# EAGLE design motor_back (EAGLE 7.7.0)
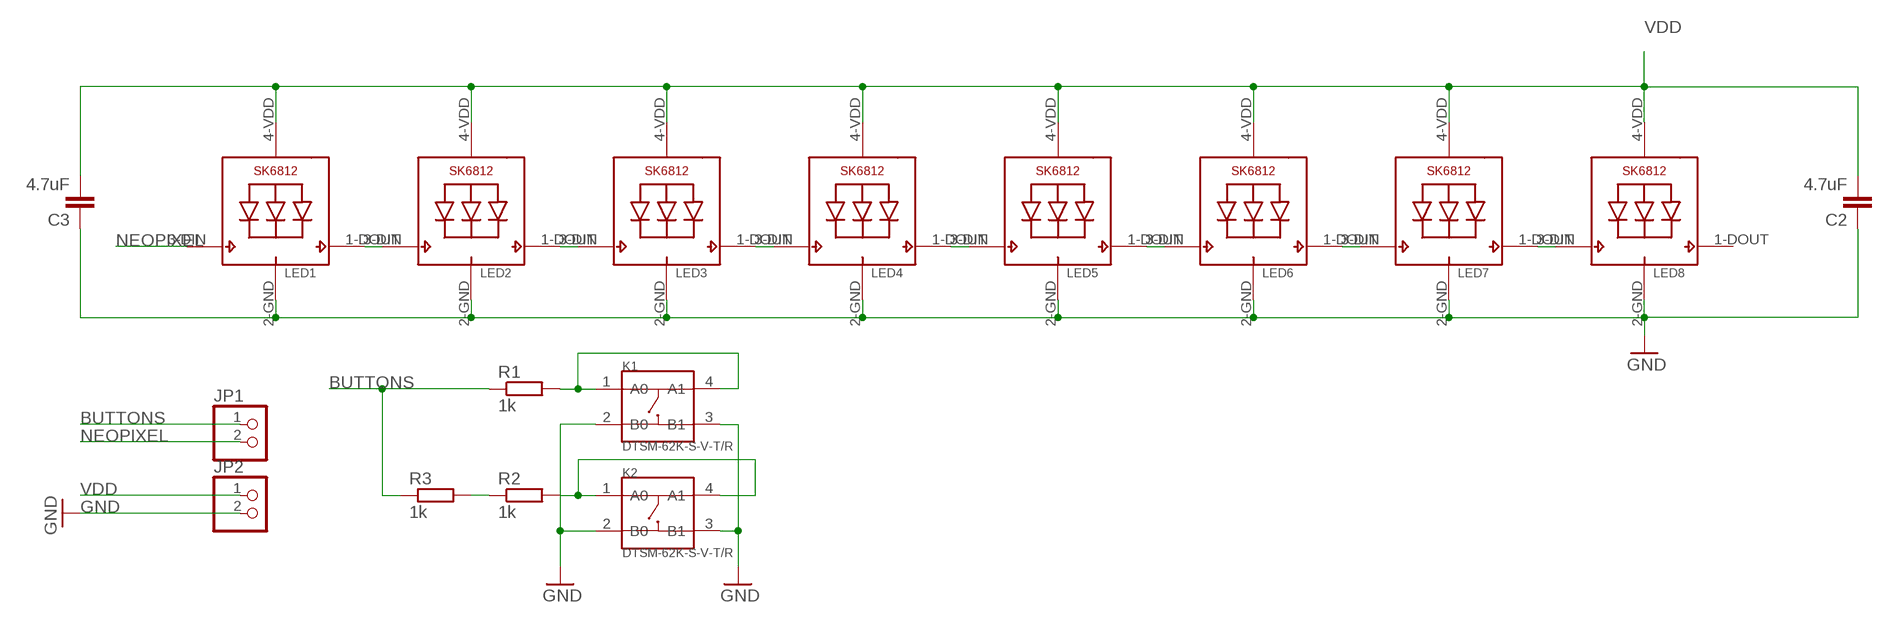
[diagram p0: schematic, sheet 1]

## Parts
C2  4.7uF  C-EUC0805  [C0805]
C3  4.7uF  C-EUC0805  [C0805]
JP1  PINHD-1X2  [1X02]
JP2  PINHD-1X2  [1X02]
K1  DTSM-62K-S-V-T/R  SMD-SWITCH-TACTILE-SPST-NO(4P-D6.0MM)  [SW4-SMD-6.0X6.0X5.0MM]
K2  DTSM-62K-S-V-T/R  SMD-SWITCH-TACTILE-SPST-NO(4P-D6.0MM)  [SW4-SMD-6.0X6.0X5.0MM]
LED1  SK6812_3535  [LED3535]
LED2  SK6812_3535  [LED3535]
LED3  SK6812_3535  [LED3535]
LED4  SK6812_3535  [LED3535]
LED5  SK6812_3535  [LED3535]
LED6  SK6812_3535  [LED3535]
LED7  SK6812_3535  [LED3535]
LED8  SK6812_3535  [LED3535]
R1  1k  R-EU_R0603  [R0603]
R2  1k  R-EU_R0603  [R0603]
R3  1k  R-EU_R0603  [R0603]

## Nets
BUTTONS: JP1.1 R1.1 R3.1
GND: C2.1 C3.1 JP2.2 K1.2(B0) K1.3(B1) K2.2(B0) K2.3(B1) LED1.2-GND(GND) LED2.2-GND(GND) LED3.2-GND(GND) LED4.2-GND(GND) LED5.2-GND(GND) LED6.2-GND(GND) LED7.2-GND(GND) LED8.2-GND(GND)
N$1: LED1.1-DOUT(DO) LED2.3-DIN(DI)
N$2: LED2.1-DOUT(DO) LED3.3-DIN(DI)
N$3: LED3.1-DOUT(DO) LED4.3-DIN(DI)
N$4: LED4.1-DOUT(DO) LED5.3-DIN(DI)
N$5: LED5.1-DOUT(DO) LED6.3-DIN(DI)
N$6: LED6.1-DOUT(DO) LED7.3-DIN(DI)
N$7: LED7.1-DOUT(DO) LED8.3-DIN(DI)
N$13: K1.1(A0) K1.4(A1) R1.2
N$14: K2.1(A0) K2.4(A1) R2.2
N$15: R2.1 R3.2
NEOPIXEL: JP1.2 LED1.3-DIN(DI)
VDD: C2.2 C3.2 JP2.1 LED1.4-VDD(VDD) LED2.4-VDD(VDD) LED3.4-VDD(VDD) LED4.4-VDD(VDD) LED5.4-VDD(VDD) LED6.4-VDD(VDD) LED7.4-VDD(VDD) LED8.4-VDD(VDD)
Unconnected: LED8.1-DOUT(DO)

## Library data of the parts
C2 C3 = rcl:C-EU: CAPACITOR, European symbol
JP1 JP2 = pinhead:PINHD-1X2: PIN HEADER
K1 K2 = Seeed-OPL-Button:SMD-SWITCH-TACTILE-SPST-NO(4P-D6.0MM): 311020004; MPN: DTSM-62K-S-V-T/R
LED1-LED8 = SK6812:SK6812
R1-R3 = rcl:R-EU_: RESISTOR, European symbol

## Board
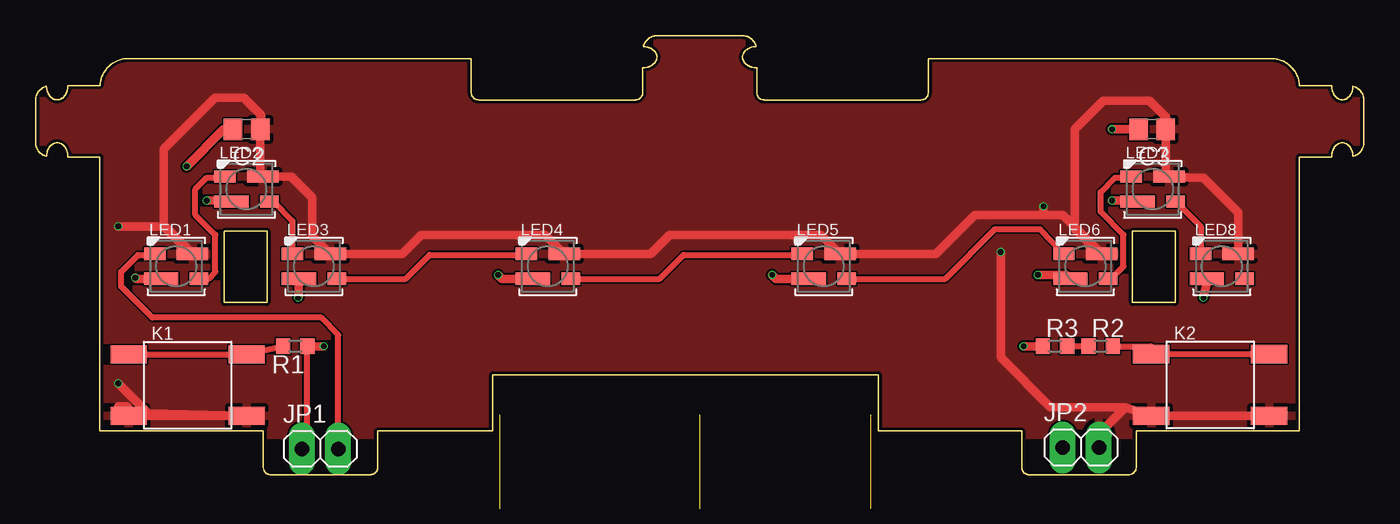
[diagram p1: board, top side]
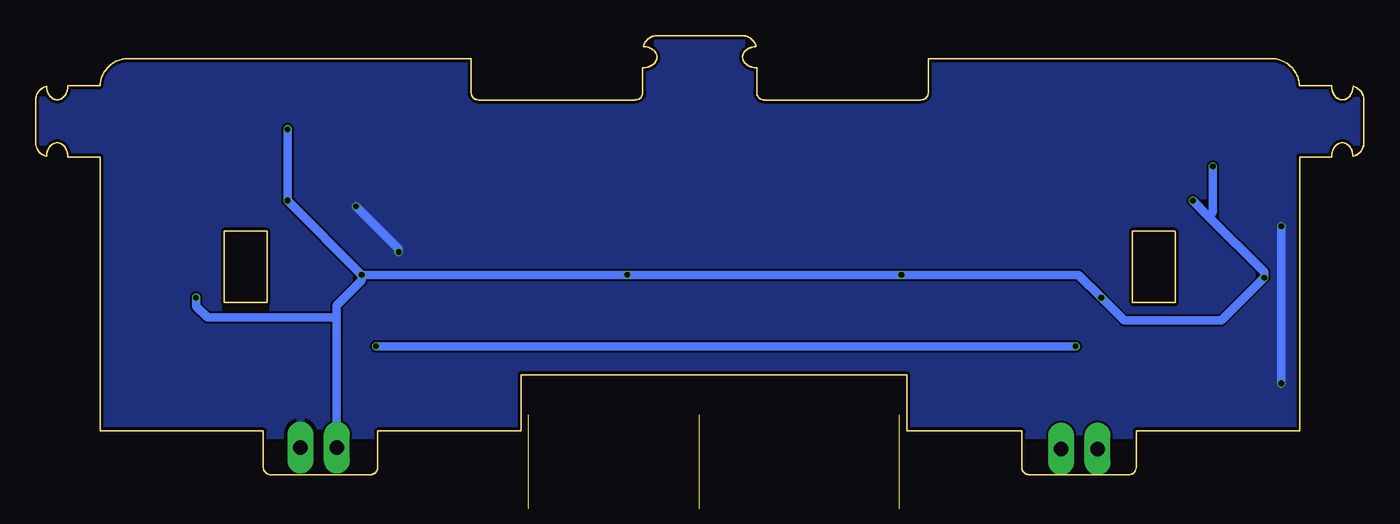
[diagram p2: board, bottom side, seen from below]

Size 93 x 30.76 mm. Coordinates in mm from the lower left corner, seen from the top.
Outline: 43.5,30.76 43.45,30.75 43.39,30.75 43.34,30.74 43.29,30.73 43.24,30.72 43.19,30.7 43.14,30.69 43.09,30.67 43.04,30.64 43,30.61 42.95,30.59 42.91,30.55 42.87,30.52 42.83,30.49 42.79,30.45 42.76,30.41 42.72,30.37 42.69,30.32 42.67,30.28 42.64,30.23 42.62,30.19 42.59,30.14 42.58,30.09 42.56,30.04 42.56,30 42.67,29.99 42.72,29.98 42.82,29.96 42.87,29.95 42.92,29.93 42.97,29.91 43.02,29.89 43.07,29.87 43.12,29.84 43.16,29.82 43.21,29.78 43.25,29.75 43.29,29.72 43.32,29.68 43.36,29.64 43.39,29.6 43.42,29.55 43.44,29.5 43.46,29.46 43.48,29.41 43.49,29.36 43.5,29.3 43.5,29.25 43.5,29.2 43.49,29.14 43.48,29.09 43.46,29.04 43.44,28.99 43.41,28.95 43.38,28.9 43.35,28.86 43.32,28.82 43.28,28.79 43.24,28.75 43.2,28.72 43.15,28.69 43.11,28.66 43.06,28.64 43.01,28.61 42.97,28.59 42.92,28.57 42.87,28.56 42.81,28.54 42.71,28.52 42.61,28.51 42.5,28.51 42.5,26.76 42.5,26.71 42.49,26.66 42.48,26.6 42.46,26.55 42.43,26.51 42.4,26.46 42.37,26.42 42.33,26.38 42.29,26.35 42.25,26.32 42.2,26.3 42.15,26.28 42.1,26.27 42.05,26.26 42,26.26 31.04,26.26 30.99,26.26 30.94,26.26 30.88,26.27 30.83,26.28 30.79,26.3 30.74,26.33 30.7,26.36 30.65,26.39 30.62,26.43 30.59,26.47 30.56,26.52 30.54,26.57 30.52,26.62 30.51,26.67 30.5,26.72 30.5,26.77 30.5,29.16 6.53,29.16 6.43,29.16 6.37,29.15 6.27,29.14 6.16,29.13 6.06,29.11 6.01,29.1 5.96,29.08 5.85,29.05 5.76,29.01 5.66,28.97 5.61,28.95 5.52,28.9 5.47,28.87 5.38,28.82 5.3,28.75 5.25,28.72 5.17,28.65 5.1,28.58 5.02,28.5 4.99,28.47 4.92,28.38 4.86,28.3 4.8,28.21 4.77,28.16 4.72,28.07 4.68,27.98 4.64,27.88 4.6,27.78 4.57,27.68 4.56,27.63 4.54,27.52 4.53,27.47 4.51,27.36 4.51,27.26 4.46,27.26 2.29,27.26 2.25,27.24 2.24,27.13 2.23,27.03 2.21,26.93 2.19,26.88 2.18,26.82 2.16,26.77 2.14,26.73 2.11,26.68 2.09,26.63 2.06,26.59 2.03,26.55 2,26.5 1.96,26.46 1.92,26.43 1.88,26.39 1.84,26.36 1.79,26.34 1.75,26.31 1.7,26.29 1.65,26.27 1.6,26.26 1.54,26.26 1.49,26.26 1.44,26.26 1.38,26.27 1.33,26.28 1.28,26.3 1.24,26.32 1.19,26.35 1.15,26.38 1.1,26.41 1.06,26.44 1.03,26.48 0.99,26.52 0.96,26.56 0.93,26.61 0.91,26.65 0.88,26.7 0.86,26.75 0.84,26.8 0.82,26.85 0.81,26.9 0.78,27 0.77,27.05 0.75,27.21 0.7,27.19 0.65,27.18 0.6,27.16 0.55,27.13 0.51,27.11 0.46,27.08 0.42,27.05 0.38,27.02 0.33,26.99 0.3,26.95 0.26,26.91 0.22,26.87 0.19,26.83 0.16,26.79 0.13,26.75 0.11,26.7 0.08,26.65 0.06,26.6 0.05,26.55 0.03,26.5 0.02,26.45 0.01,26.4 0,26.34 0,26.29 0,23.28 0,23.22 0,23.17 0.01,23.12 0.02,23.07 0.03,23.01 0.04,22.96 0.06,22.91 0.08,22.86 0.1,22.82 0.13,22.77 0.16,22.73 0.19,22.68 0.22,22.64 0.26,22.6 0.29,22.56 0.33,22.53 0.37,22.49 0.42,22.46 0.46,22.43 0.51,22.41 0.55,22.38 0.6,22.36 0.65,22.34 0.7,22.32 0.75,22.31 0.76,22.35 0.77,22.46 0.79,22.56 0.8,22.61 0.82,22.66 0.84,22.71 0.86,22.76 0.88,22.81 0.9,22.86 0.93,22.9 0.96,22.95 0.99,22.99 1.03,23.03 1.06,23.07 1.1,23.1 1.14,23.14 1.19,23.16 1.23,23.19 1.28,23.21 1.33,23.23 1.38,23.24 1.43,23.25 1.49,23.26 1.54,23.25 1.59,23.25 1.64,23.24 1.69,23.22 1.74,23.2 1.79,23.18 1.84,23.15 1.88,23.12 1.92,23.09 1.96,23.05 1.99,23.01 2.03,22.97 2.06,22.93 2.09,22.88 2.11,22.84 2.14,22.79 2.16,22.74 2.18,22.69 2.19,22.64 2.21,22.59 2.23,22.49 2.24,22.38 2.25,22.28 2.28,22.26 4.45,22.26 4.5,22.25 4.5,3.1 4.51,3.06 15.94,3.06 15.94,3 15.94,0.52 15.94,0.47 15.95,0.41 15.96,0.36 15.98,0.31 16,0.26 16.03,0.22 16.06,0.18 16.1,0.14 16.14,0.1 16.18,0.07 16.23,0.05 16.28,0.03 16.33,0.01 16.38,0 16.43,0 16.49,0 23.42,0 23.47,0 23.52,0.01 23.58,0.02 23.63,0.04 23.67,0.06 23.72,0.08 23.76,0.12 23.8,0.15 23.84,0.19 23.87,0.23 23.89,0.28 23.91,0.33 23.93,0.38 23.94,0.43 23.94,0.48 23.94,0.54 23.94,3.02 23.96,3.06 32,3.06 32,7 59,7 59,3.06 69.04,3.06 69.06,3.02 69.06,0.53 69.06,0.48 69.06,0.42 69.07,0.37 69.09,0.32 69.11,0.27 69.14,0.23 69.17,0.18 69.21,0.15 69.24,0.11 69.29,0.08 69.33,0.05 69.38,0.03 69.43,0.02 69.48,0.01 69.54,0 69.59,0 76.52,0 76.57,0 76.63,0.01 76.68,0.01 76.73,0.03 76.78,0.05 76.82,0.08 76.87,0.11 76.91,0.14 76.94,0.18 76.97,0.23 77,0.27 77.02,0.32 77.04,0.37 77.05,0.42 77.06,0.47 77.06,0.53 77.06,3.01 77.07,3.06 88.49,3.06 88.5,3.1 88.5,22.21 88.5,22.26 90.72,22.26 90.75,22.28 90.76,22.39 90.77,22.49 90.78,22.55 90.79,22.6 90.81,22.65 90.83,22.7 90.85,22.75 90.87,22.8 90.89,22.84 90.92,22.89 90.95,22.93 90.98,22.98 91.01,23.02 91.05,23.06 91.09,23.09 91.13,23.12 91.17,23.16 91.22,23.18 91.26,23.21 91.31,23.23 91.36,23.24 91.42,23.25 91.47,23.26 91.52,23.26 91.57,23.25 91.63,23.24 91.68,23.23 91.73,23.21 91.77,23.19 91.82,23.16 91.86,23.13 91.9,23.1 91.94,23.06 91.98,23.02 92.01,22.98 92.04,22.94 92.07,22.89 92.1,22.85 92.12,22.8 92.15,22.75 92.17,22.7 92.18,22.66 92.2,22.6 92.21,22.55 92.23,22.45 92.24,22.34 92.26,22.31 92.31,22.32 92.36,22.34 92.41,22.36 92.45,22.39 92.5,22.41 92.55,22.44 92.59,22.47 92.63,22.5 92.67,22.53 92.71,22.57 92.75,22.61 92.78,22.65 92.82,22.69 92.85,22.73 92.87,22.78 92.9,22.82 92.92,22.87 92.94,22.92 92.96,22.97 92.97,23.02 92.98,23.07 92.99,23.13 93,23.18 93,23.23 93,23.28 93,26.3 93,26.35 92.99,26.41 92.98,26.46 92.97,26.51 92.95,26.56 92.93,26.61 92.91,26.66 92.89,26.71 92.86,26.75 92.84,26.8 92.8,26.84 92.77,26.88 92.74,26.92 92.7,26.96 92.66,26.99 92.62,27.03 92.57,27.06 92.53,27.09 92.48,27.11 92.44,27.14 92.39,27.16 92.34,27.18 92.29,27.19 92.24,27.2 92.23,27.1 92.22,26.99 92.19,26.89 92.18,26.84 92.16,26.79 92.14,26.74 92.12,26.69 92.09,26.65 92.06,26.6 92.03,26.56 92,26.52 91.97,26.48 91.93,26.44 91.89,26.4 91.85,26.37 91.8,26.34 91.76,26.32 91.71,26.3 91.66,26.28 91.61,26.27 91.55,26.26 91.5,26.26 91.45,26.26 91.4,26.27 91.34,26.28 91.29,26.29 91.25,26.32 91.2,26.34 91.15,26.37 91.11,26.4 91.07,26.43 91.03,26.47 91,26.51 90.97,26.55 90.94,26.59 90.91,26.64 90.88,26.69 90.86,26.73 90.84,26.78 90.82,26.83 90.8,26.88 90.79,26.93 90.77,27.04 90.75,27.14 90.75,27.25 90.71,27.26 88.54,27.26 88.49,27.27 88.49,27.37 88.47,27.48 88.46,27.53 88.44,27.63 88.41,27.74 88.4,27.79 88.36,27.89 88.32,27.98 88.27,28.08 88.25,28.13 88.2,28.22 88.14,28.3 88.07,28.39 88.01,28.47 87.97,28.51 87.9,28.59 87.82,28.66 87.74,28.73 87.65,28.79 87.61,28.82 87.52,28.88 87.43,28.93 87.38,28.95 87.29,29 87.24,29.02 87.14,29.05 87.04,29.08 86.99,29.1 86.88,29.12 86.78,29.14 86.72,29.14 86.62,29.15 86.57,29.16 86.46,29.16 62.54,29.16 62.5,29.15 62.5,26.77 62.5,26.71 62.49,26.66 62.48,26.61 62.46,26.56 62.44,26.51 62.41,26.47 62.38,26.43 62.34,26.39 62.3,26.36 62.25,26.32 62.21,26.3 62.16,26.28 62.11,26.27 62.05,26.26 62,26.26 51.05,26.26 51,26.26 50.94,26.26 50.89,26.27 50.84,26.28 50.79,26.3 50.74,26.33 50.7,26.36 50.66,26.39 50.62,26.43 50.59,26.47 50.56,26.51 50.54,26.56 50.52,26.61 50.51,26.66 50.5,26.71 50.5,26.77 50.5,28.46 50.49,28.51 50.39,28.51 50.28,28.52 50.18,28.55 50.13,28.56 50.08,28.58 50.03,28.59 49.98,28.61 49.93,28.64 49.88,28.66 49.84,28.69 49.8,28.72 49.75,28.75 49.71,28.79 49.68,28.83 49.64,28.87 49.61,28.91 49.58,28.95 49.56,29 49.54,29.05 49.52,29.1 49.51,29.15 49.5,29.2 49.5,29.26 49.5,29.31 49.51,29.36 49.52,29.41 49.54,29.46 49.56,29.51 49.59,29.56 49.61,29.6 49.65,29.64 49.68,29.68 49.72,29.72 49.76,29.76 49.8,29.79 49.84,29.82 49.89,29.85 49.94,29.87 49.98,29.89 50.03,29.91 50.08,29.93 50.13,29.95 50.24,29.97 50.34,29.99 50.45,30 50.44,30.05 50.42,30.1 50.4,30.14 50.38,30.19 50.36,30.24 50.33,30.29 50.3,30.33 50.27,30.37 50.24,30.41 50.2,30.45 50.16,30.49 50.12,30.53 50.08,30.56 50.04,30.59 50,30.62 49.95,30.65 49.9,30.67 49.85,30.69 49.8,30.71 49.75,30.72 49.7,30.73 49.65,30.75 49.6,30.75 49.54,30.75 43.51,30.76
Outline: 13.24,17.06 16.15,17.06 16.2,17.05 16.2,12.08 16.17,12.06 13.21,12.06 13.2,12.1 13.2,17.02
Outline: 76.82,17.06 79.78,17.06 79.8,17.02 79.8,12.1 79.79,12.06 76.83,12.06 76.8,12.08 76.8,17.06
Copper layers (1*16): Top 0.035mm / dielectric 1.6mm / Bottom 0.035mm
Design rules "jlcpcb-2layers *": minimum track width 5mil, minimum drill 0.3mm, track to track 5mil, track to pad 5mil, pad to pad 5mil, via to via 5mil, smd to smd 5mil, copper to edge 0.2mm, drill to drill 6mil, minimum pad ring 10mil, minimum via ring 3mil, stop-mask expansion 4mil, vias tented up to drill 25mil, thermal gap 10mil

### Footprints (pad centres in the part's own frame; a part is rotated, then mirrored left to right if it is on the bottom)
C0805 = smd 1.3 x 1.5: 1 -0.95,0; 2 0.95,0
1X02 = drill 1.016 long: 1 -1.27,0; 2 1.27,0
SW4-SMD-6.0X6.0X5.0MM = smd 2.54 x 1.27: 1 -4.129,2.159; 2 -4.129,-2.159; 3 4.129,-2.159; 4 4.129,2.159
LED3535 = smd 1.3 x 0.85: 1-DOUT 1.6,-0.875 | smd 2.2 x 0.85: 2-GND 1.15,0.875 | smd 1.5 x 0.85: 3-DIN -1.5,0.875 | smd 2.4 x 0.85: 4-VDD -1.05,-0.875
R0603 = smd 1 x 1.1: 1 -0.85,0; 2 0.85,0

### Placement (x,y rotation side)
C2  14.77,24.2 180 top
C3  78.17,24.2 180 top
JP1  19.92,1.8 0 top
JP2  73.19,1.91 0 top
K1  10.64,6.27 0 top
K2  82.24,6.29 0 top
LED1  9.84,14.6 0 top
LED2  14.76,20 0 top
LED3  19.48,14.6 0 top
LED4  35.86,14.6 0 top
LED5  55.18,14.6 0 top
LED6  73.5,14.6 0 top
LED7  78.22,20 0 top
LED8  83.06,14.6 0 top
R1  18.17,9 180 top
R2  74.57,9 0 top
R3  71.37,9 0 top

### Tracks (layer width: path | path; a pad name or v marks a point on that pad's centre or on a via)
BUTTONS  (via drill 0.4)
  Top 0.406: R1.1 18.97,9 18.97,2.13 JP1.1
  Top 0.61: R3.1 v69.17,9 | v20.17,9 R1.1
  Bottom 0.61: v69.17,9 v20.17,9
GND  (via drill 0.4)
  Top 0.61: 76.3,4.73 K2.2 K2.3 | 76.3,4.73 74.37,2.8 74.37,1.99 JP2.2 | K2.3 86.5,4.13 86.37,4.4 86.64,4.2 K2.3 | LED8.2-GND 84.21,18.36 81.77,20.8 79.44,20.8 LED7.2-GND 79.12,21.12 C3.1 79.17,24.25 79.17,25 77.97,26.2 74.77,26.2 72.77,24.2 72.77,17.2 74.5,15.47 LED6.2-GND 71.92,18.2 70.77,18.2 | 76.3,4.73 71.05,4.73 67.57,8.2 v67.57,15.6 | K1.2 K1.3 7.87,4.31 v5.77,6.4 | K1.2 5.87,4.71 5.77,4.8 6.42,4.8 K1.2 | 70.77,18.2 65.77,18.2 63.05,15.47 LED5.2-GND 55,16.8 44.37,16.8 43.05,15.47 LED4.2-GND 35.68,16.8 26.97,16.8 25.65,15.47 LED3.2-GND 19.37,16.73 19.37,19.4 17.9,20.88 LED2.2-GND 15.72,21.06 C2.1 15.77,24.25 15.77,25.2 14.57,26.4 12.57,26.4 8.97,22.8 8.97,17.4 | v70.57,18.8 70.57,18.4 70.77,18.2 | v5.77,17.4 8.97,17.4 | 8.97,17.4 9.06,17.4 LED1.2-GND 10.9,15.47 8.97,17.4
  Bottom 0.61: v67.57,15.6 67.57,15.8 v70.57,18.8 | v5.77,6.4 v5.77,17.4
  pour Top: -0.23,31.2 92.57,31.2 92.57,2.8 -0.23,2.8
  pour Bottom: -0.23,31 92.57,31 92.57,2.8 -0.23,2.8
N$1
  Top 0.406: LED1.1-DOUT 12.1,13.72 12.57,14.2 12.57,16.8 11.17,18.2 11.17,20 11.97,20.8 13.18,20.8 LED2.3-DIN
N$2
  Top 0.406: LED2.1-DOUT 16.65,19.12 17.97,17.8 LED3.3-DIN
N$3
  Top 0.406: LED3.1-DOUT 25.9,13.72 27.57,15.4 34.28,15.4 LED4.3-DIN
N$4
  Top 0.406: LED4.1-DOUT 43.7,13.72 45.37,15.4 53.6,15.4 LED5.3-DIN
N$5
  Top 0.406: LED5.1-DOUT 63.7,13.72 67.17,17.2 70.32,17.2 LED6.3-DIN
N$6
  Top 0.406: LED6.1-DOUT 75.3,13.72 76.17,14.6 76.17,16.8 74.57,18.4 74.57,19.8 75.57,20.8 76.64,20.8 LED7.3-DIN
N$7
  Top 0.406: LED7.1-DOUT 79.85,19.12 81.57,17.4 81.57,15.49 LED8.3-DIN
N$8  (3 unrouted)
N$13
  Top 0.406: K1.1 K1.4 17.32,9.03 R1.2
N$14
  Top 0.406: R2.2 78.11,9 K2.1 K2.4
N$15
  Top 0.406: R2.1 R3.2
NEOPIXEL
  Top 0.406: JP1.2 21.19,9.79 19.97,11 8.17,11 5.97,13.2 5.97,14.2 7.17,15.4 8.26,15.4 LED1.3-DIN
VDD  (via drill 0.4)
  Top 0.61: LED1.4-VDD 7.05,13.72 v6.97,13.8 | v11.97,19.2 13.63,19.2 LED2.4-VDD | LED8.4-VDD 82.01,13.44 v81.77,12.4 | v75.37,24.2 C3.2 | v75.37,19.2 77.09,19.2 LED7.4-VDD | v70.17,14 72.17,14 LED6.4-VDD | LED3.4-VDD 18.43,12.46 v18.37,12.4 | LED4.4-VDD 32.65,13.72 v32.37,14 | LED5.4-VDD 51.85,13.72 v51.57,14 | C2.2 13.17,24.2 v10.57,21.6
  Bottom 0.61: 10.87,18.1 6.97,14.2 v6.97,13.8 9.97,10.8 16.77,10.8 v18.37,12.4 | 10.87,18.1 v11.97,19.2 | JP2.1 71.92,11 | 71.92,11 71.92,11.85 70.17,13.6 v70.17,14 | v70.17,14 v75.37,19.2 v75.37,24.2 | v81.77,12.4 81.77,11.8 80.97,11 71.92,11 | v70.17,14 v51.57,14 v32.37,14 19.97,14 v18.37,12.4 | v18.37,12.4 18.17,12.2 | v10.57,21.6 10.57,18.4 10.87,18.1